# Altium project Lab1.PrjPcb
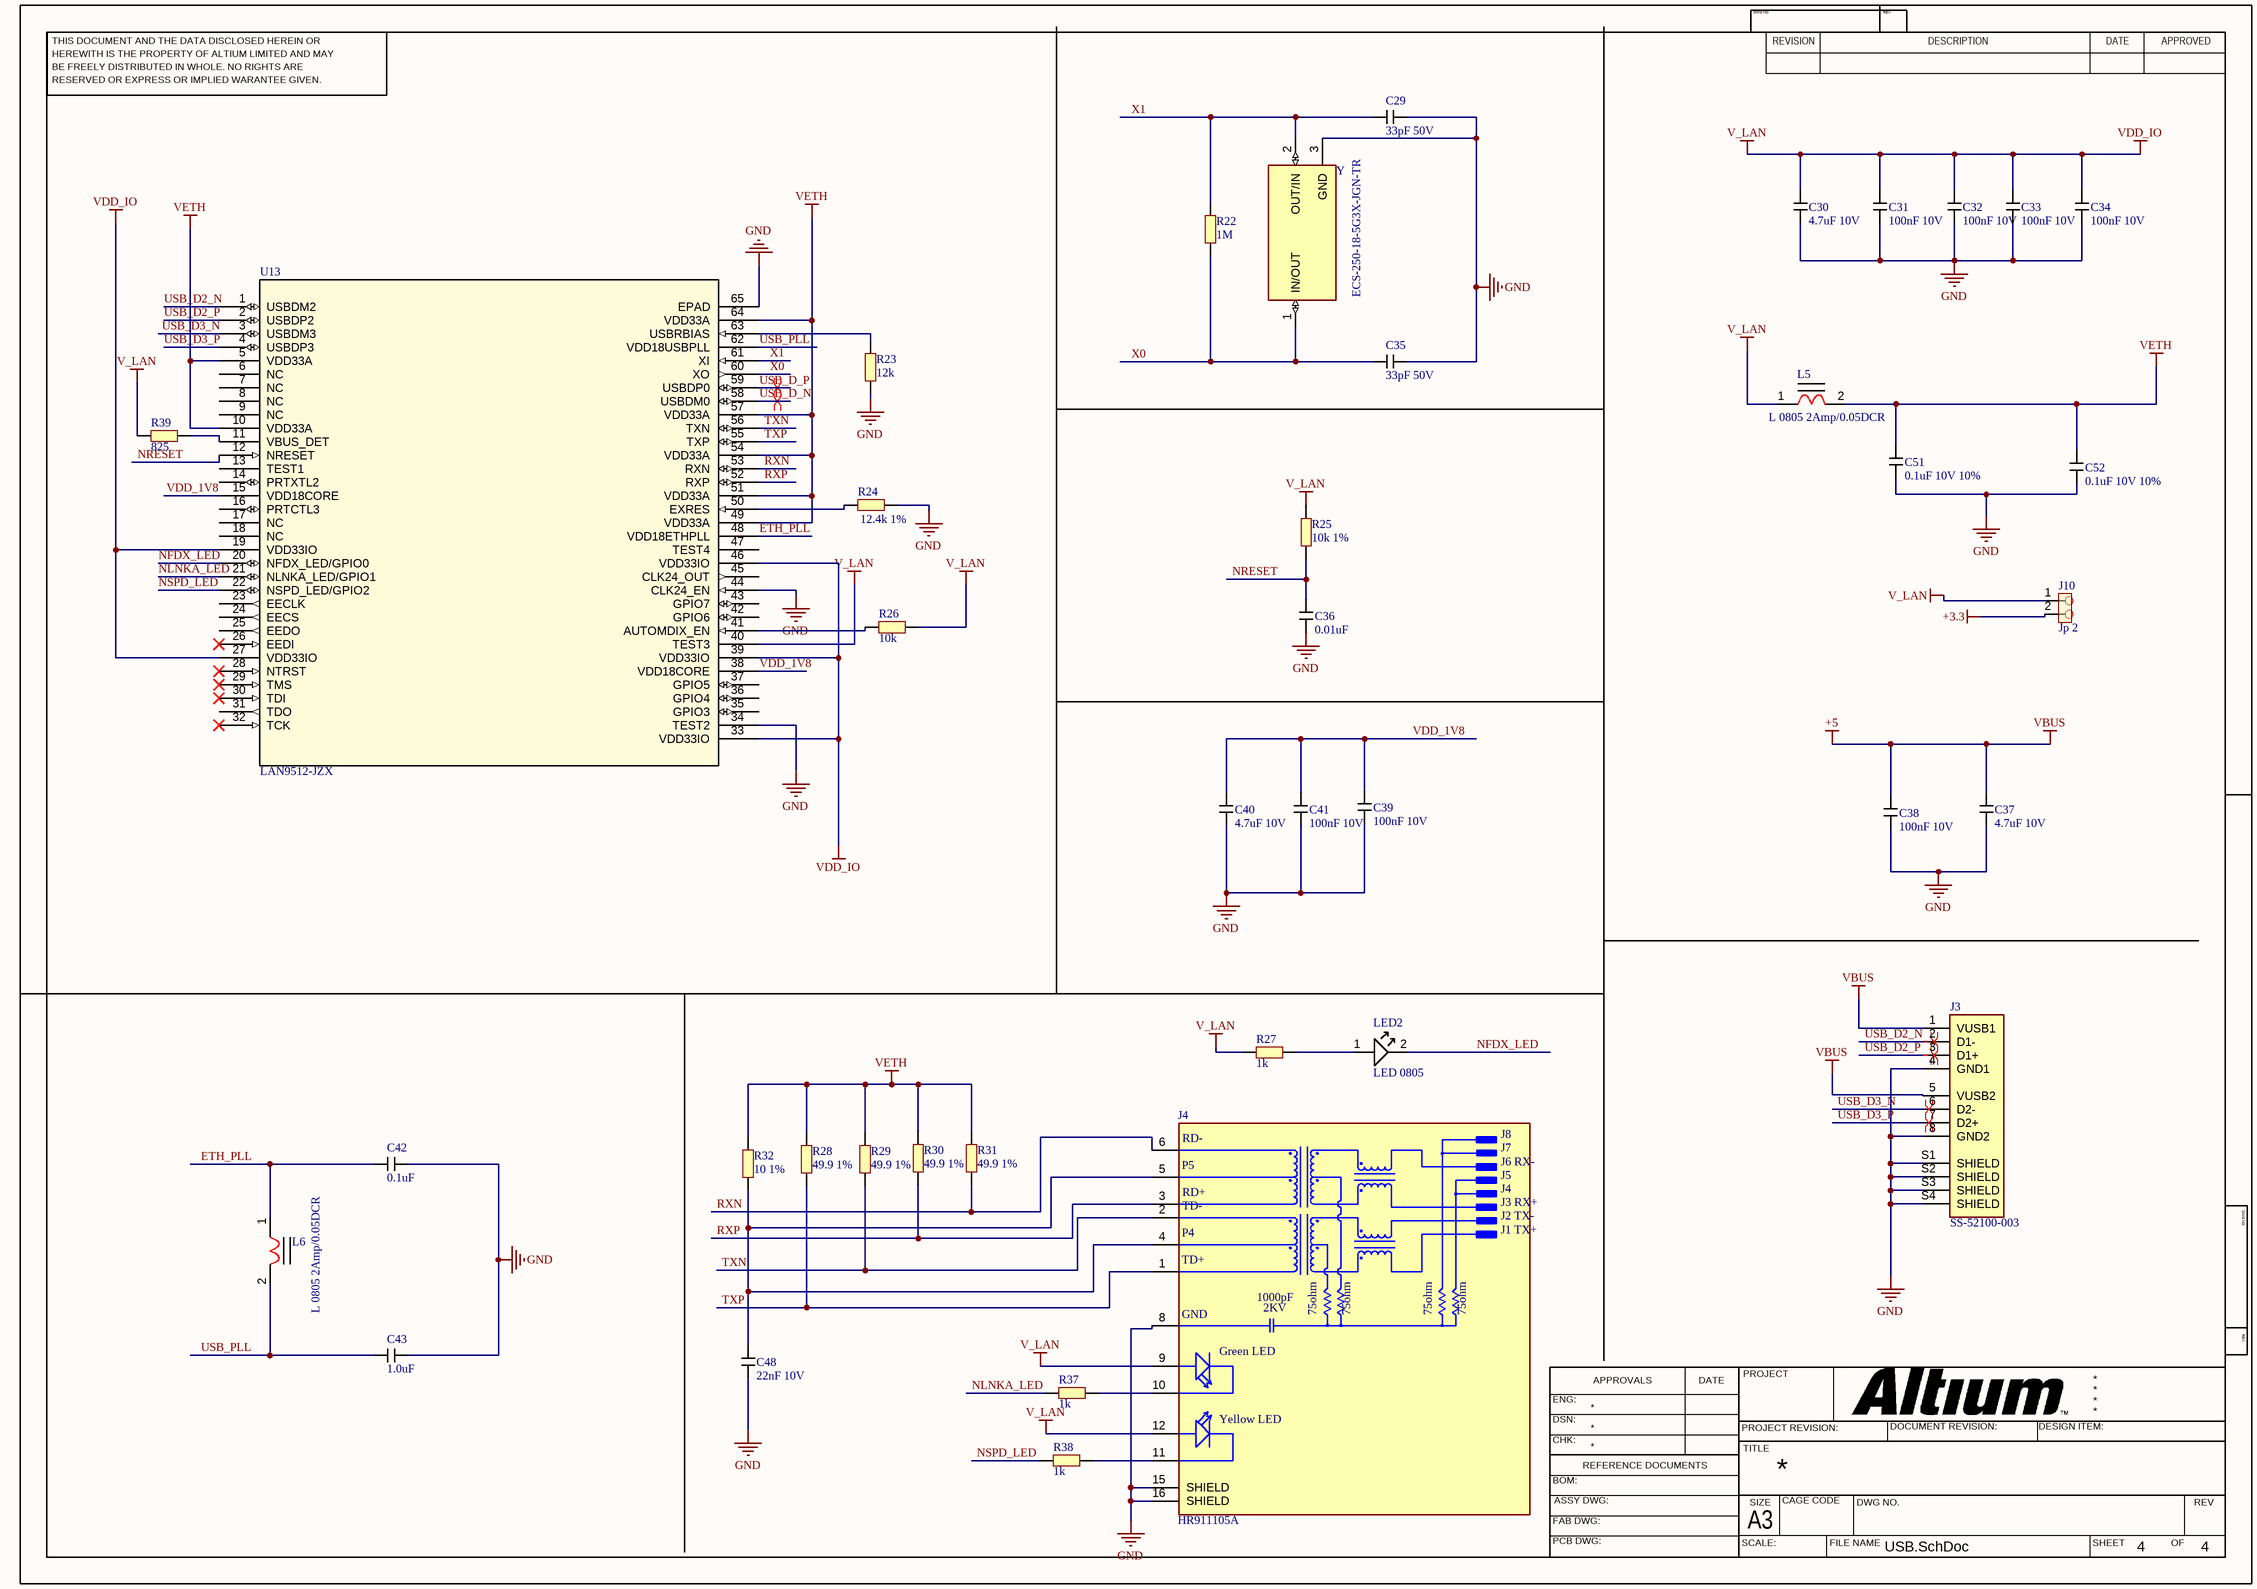
[diagram p0: USB.SchDoc]
1 sheet, 40 parts. Net scope: global (net labels, ports and power ports of the same name join across sheets).
Board file: lab1.PcbDoc

## Sheet USB.SchDoc
size 420 x 297 mm; SheetNumber: 4; SheetTotal: 4

### Parts
C29  33pF 50V  [c 0805]
C30  4.7uF 10V  [c 0805]
C31  100nF 10V  [c 0805]
C32  100nF 10V  [c 0805]
C33  100nF 10V  [c 0805]
C34  100nF 10V  [c 0805]
C35  33pF 50V  [c 0805]
C36  0.01uF  [c 0805]
C37  4.7uF 10V  [c 0805]
C38  100nF 10V  [c 0805]
C39  100nF 10V  [c 0805]
C40  4.7uF 10V  [c 0805]
C41  100nF 10V  [c 0805]
C42  0.1uF  [c 0805]
C43  1.0uF  [c 0805]
C48  22nF 10V  [c 0805]
C51  0.1uF 10V 10%  [c 0805]
C52  0.1uF 10V 10%  [c 0805]
J3  SS-52100-003  [BEL_SS-52100-003]
J4  HR911105A  [HANRUN_HR911105A]
J10  Jp 2  [Jp2]
L5  L 0805 2Amp/0.05DCR  [Ferrite 0805]
L6  L 0805 2Amp/0.05DCR  [Ferrite 0805]
LED2  LED 0805  [LED 0805]
R22  1M  [R 0805]
R23  12k  [R 0805]
R24  12.4k 1%  [R 0805]
R25  10k 1%  [R 0805]
R26  10k  [R 0805]
R27  1k  [R 0805]
R28  49.9 1%  [R 0805]
R29  49.9 1%  [R 0805]
R30  49.9 1%  [R 0805]
R31  49.9 1%  [R 0805]
R32  10 1%  [R 0805]
R37  1k  [R 0805]
R38  1k  [R 0805]
R39  825  [R 0805]
U13  LAN9512-JZX  [QFN50P900X900X100-65N-D]
Y  ECS-250-18-5G3X-JGN-TR  [XTAL_ECS-250-18-5G3X-JGN-TR]

### Nets
+3.3: J10.2
+5: C37.2 C38.1 J3.1(VUSB1) J3.5(VUSB2)  [also labelled VBUS]
GND: C29.2 C30.1 C31.1 C32.1 C33.1 C34.1 C35.2 C36.1 C37.1 C38.2 C39.1 C40.1 C41.1 C42.2 C43.1 C48.2 C51.1 C52.1 J3.4(GND1) J3.8(GND2) J3.S1(SHIELD) J3.S2(SHIELD) J3.S3(SHIELD) J3.S4(SHIELD) J4.8(GND) J4.15(SHIELD) J4.16(SHIELD) R23.1 R24.2 U13.34(TEST2) U13.44(CLK24_EN) U13.65(EPAD) Y.3(GND)
V_LAN: C30.2 C31.2 C32.2 C33.2 C34.2 J4.9(GA) J4.12(YA) J10.1 L5.1 R25.2 R26.2 R27.1 R39.1 U13.19(VDD33IO) U13.27(VDD33IO) U13.33(VDD33IO) U13.39(VDD33IO) U13.40(TEST3) U13.46(VDD33IO)  [also labelled VDD_IO]
VETH: C51.2 C52.2 L5.2 R28.2 R29.2 R30.2 R31.2 R32.2 U13.5(VDD33A) U13.10(VDD33A) U13.49(VDD33A) U13.51(VDD33A) U13.54(VDD33A) U13.57(VDD33A) U13.64(VDD33A)
ETH_PLL: C42.1 L6.1 U13.48(VDD18ETHPLL)
NFDX_LED: LED2.2 U13.20(NFDX_LED/GPIO0)
NLNKA_LED: R37.1 U13.21(NLNKA_LED/GPIO1)
NRESET: C36.2 R25.1 U13.12(NRESET)
NSPD_LED: R38.1 U13.22(NSPD_LED/GPIO2)
RXN: J4.6(RD-) R31.1 U13.53(RXN)
RXP: J4.3(RD+) R30.1 U13.52(RXP)
TXN: J4.2(TD-) R29.1 U13.56(TXN)
TXP: J4.1(TD+) R28.1 U13.55(TXP)
USB_D2_N: J3.2(D1-) U13.1(USBDM2)
USB_D2_P: J3.3(D1+) U13.2(USBDP2)
USB_D3_N: J3.6(D2-) U13.3(USBDM3)
USB_D3_P: J3.7(D2+) U13.4(USBDP3)
USB_D_N: U13.58(USBDM0)
USB_D_P: U13.59(USBDP0)
USB_PLL: C43.2 L6.2 U13.62(VDD18USBPLL)
VDD_1V8: C39.2 C40.2 C41.2 U13.15(VDD18CORE) U13.38(VDD18CORE)
X0: C35.1 R22.1 U13.60(XO) Y.1(IN/OUT)
X1: C29.1 R22.2 U13.61(XI) Y.2(OUT/IN)
NetC48_1: C48.1 J4.4(P4) J4.5(P5) R32.1
NetJ4_10: J4.10(GC) R37.2
NetJ4_11: J4.11(YC) R38.2
NetLED2_1: LED2.1 R27.2
NetR23_2: R23.2 U13.63(USBRBIAS)
NetR24_1: R24.1 U13.50(EXRES)
NetR26_1: R26.1 U13.41(AUTOMDIX_EN)
NetR39_2: R39.2 U13.11(VBUS_DET)

Not connected (* = marked no-connect by the designer): U13 6(NC) 7(NC) 8(NC) 9(NC) 13(TEST1) 14(PRTXTL2) 16(PRTCTL3) 17(NC) 18(NC) 23(EECLK) 24(EECS) 25(EEDO) 26(EEDI)* 28(NTRST)* 29(TMS)* 30(TDI)* 31(TDO) 32(TCK)* 35(GPIO3) 36(GPIO4) 37(GPIO5) 42(GPIO6) 43(GPIO7) 45(CLK24_OUT) 47(TEST4)

### Layout directives
differential pair: USB_D2_N, USB_D2_P, USB_D3_N, USB_D3_P, USB_D_N, USB_D_P

### Notes on the sheet
- THIS DOCUMENT AND THE DATA DISCLOSED HEREIN OR
- HEREWITH IS THE PROPERTY OF ALTIUM LIMITED AND MAY
- DWG NO:
- REVISION
- REV:
- DESCRIPTION
- DATE
- APPROVED
- BE FREELY DISTRIBUTED IN WHOLE. NO RIGHTS ARE
- RESERVED OR EXPRESS OR IMPLIED WARANTEE GIVEN.
- ENG:
- APPROVALS
- PROJECT
- DSN:
- CHK:
- REFERENCE DOCUMENTS
- PROJECT REVISION:
- TITLE
- DOCUMENT REVISION:
- DESIGN ITEM:
- BOM:
- FAB DWG:
- PCB DWG:
- ASSY DWG:
- SCALE:
- A3
- SIZE
- CAGE CODE
- FILE NAME
- DWG NO.
- SHEET
- OF
- REV
- (in symbol HR911105A) J8; J7; J6 RX-; J5; J3 RX+; J2 TX-; J1 TX+; 1000pF; 2KV; 75ohm; Green LED; Yellow LED

### Library data of the parts
C29-C43 C48 C51 C52 = C 0805
J3 = SS-52100-003: USB 2.0 - A Connector | 2 Port | Stacked Right Angle Receptacle | Shielded; MF: Stewart Connector; Digi-Key_Part_Number: 380-1414-ND; SnapEDA_Link: https://www.snapeda.com/parts/SS-52100-003/Stewart+Connector/view-part/?ref=snap; Check_prices: https://www.snapeda.com/parts/SS-52100-003/Stewart+Connector/view-part/?ref=eda; Package: None; Purchase-URL: https://pricing.snapeda.com/search/part/SS-52100-003/?ref=eda; MP: SS-52100-003; Value: *
J4 = HR911105A: DIP RJ45 Connector;; MF: hanrun; SnapEDA_Link: https://www.snapeda.com/parts/HR911105A/HanRun/view-part/?ref=snap; Package: None; MP: HR911105A; Check_prices: https://www.snapeda.com/parts/HR911105A/HanRun/view-part/?ref=eda; Price: None; Value: *; Availability: Not in stock
L5 L6 = Ferite 0805
R22-R32 R37-R39 = R 0805
U13 = LAN9512-JZX-TR: No Description Available; Mfr_Name: Microchip; Copyright: Copyright (C) 2023 Ultra Librarian. All rights reserved.; Manufacturer_Part_Number: LAN9512-JZX-TR; RefDes: RefDes; Type: DEV
Y = ECS-250-18-5G3X-JGN-TR: 25MHz Â±20ppm Crystal 18pF 30 Ohms HC-49/US; MF: ECS Inc.; MP: ECS-250-18-5G3X-JGN-TR; Value: *; Availability: Warning; Package: HC-49/US ECS Inc.; DigiKey-Purchase-URL: https://snapeda.com/shop?store=DigiKey&id=3224549; SnapEDA_Link: https://www.snapeda.com/parts/ECS-250-18-5G3X-JGN-TR/ECS%20Inc./view-part/3224549/?ref=snap; Price: None